# EAGLE design pneumaticsBoard (EAGLE 8.3.2)
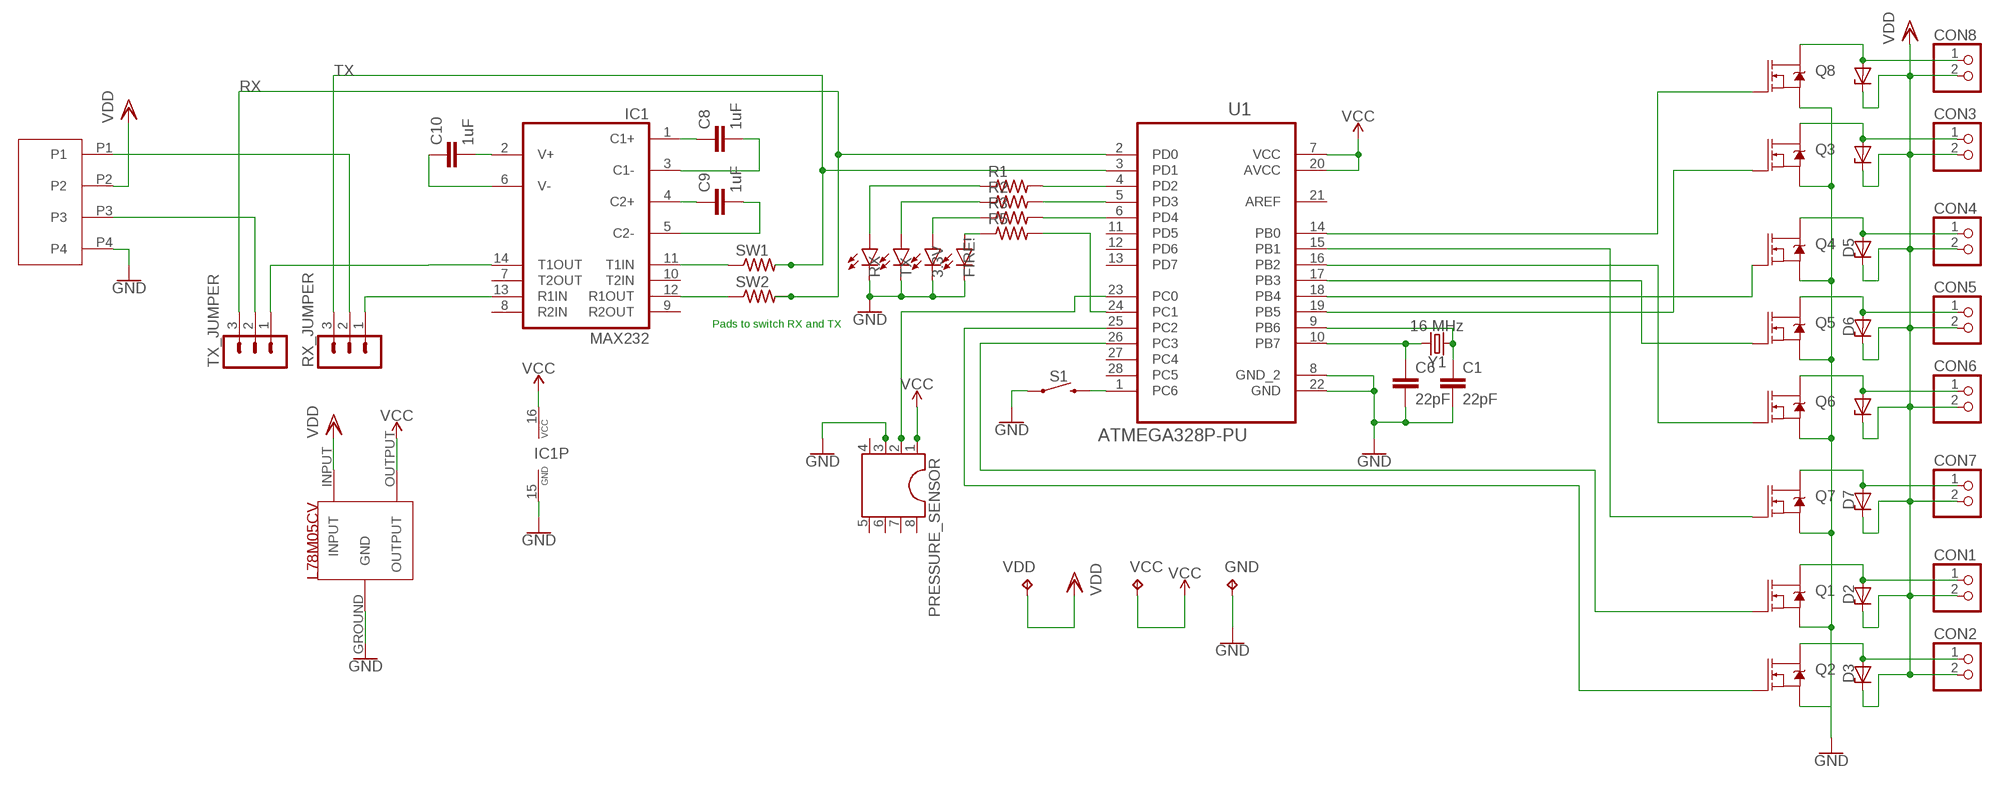
[diagram p0: schematic, sheet 1]

## Parts
3.3V  BLUE  LED-BLUE0603  [LED-0603]
C1  22pF  470PF-0603-50V-5%  [0603]
C6  22pF  470PF-0603-50V-5%  [0603]
C8  1uF  470PF-0603-50V-5%  [0603]
C9  1uF  470PF-0603-50V-5%  [0603]
C10  1uF  470PF-0603-50V-5%  [0603]
CON1  PINHD-1X2  [1X02]
CON2  PINHD-1X2  [1X02]
CON3  PINHD-1X2  [1X02]
CON4  PINHD-1X2  [1X02]
CON5  PINHD-1X2  [1X02]
CON6  PINHD-1X2  [1X02]
CON7  PINHD-1X2  [1X02]
CON8  PINHD-1X2  [1X02]
D1  BZX90  [DO34Z7]
D2  BZX90  [DO34Z7]
D3  BZX90  [DO34Z7]
D4  BZX90  [DO34Z7]
D5  BZX90  [DO34Z7]
D6  BZX90  [DO34Z7]
D7  BZX90  [DO34Z7]
D8  BZX90  [DO34Z7]
FIRE!  BLUE  LED-BLUE0603  [LED-0603]
GND  TPTP11R  [TP11R]
IC1  MAX232  [DIL16]
PRESSURE_SENSOR  DIL8  [DIL08]
Q1  60V/32A/35mΩ  MOSFET-NCH-FQP30N06L  [TO220V]
Q2  60V/32A/35mΩ  MOSFET-NCH-FQP30N06L  [TO220V]
Q3  60V/32A/35mΩ  MOSFET-NCH-FQP30N06L  [TO220V]
Q4  60V/32A/35mΩ  MOSFET-NCH-FQP30N06L  [TO220V]
Q5  60V/32A/35mΩ  MOSFET-NCH-FQP30N06L  [TO220V]
Q6  60V/32A/35mΩ  MOSFET-NCH-FQP30N06L  [TO220V]
Q7  60V/32A/35mΩ  MOSFET-NCH-FQP30N06L  [TO220V]
Q8  60V/32A/35mΩ  MOSFET-NCH-FQP30N06L  [TO220V]
R1  R-US_0204/2V  [0204V]
R2  R-US_0204/2V  [0204V]
R3  R-US_0204/2V  [0204V]
R5  R-US_0204/2V  [0204V]
RX  BLUE  LED-BLUE0603  [LED-0603]
RX_JUMPER  MA03-1  [MA03-1]
S1  MOMENTARY-SWITCH-SPST-PTH-6.0MM  [TACTILE_SWITCH_PTH_6.0MM]
SW1  R-US_0204/2V  [0204V]
SW2  R-US_0204/2V  [0204V]
TX  BLUE  LED-BLUE0603  [LED-0603]
TX_JUMPER  MA03-1  [MA03-1]
U1  ATMEGA328P-PU  [DIP254P762X457-28]
U$1  L78M05CV  [L78M05CV]
U$2  MINI_FIT_JR_4PIN_VERT  [MINI_FIT_JR_4PIN_VERT]
VCC  TPTP11R  [TP11R]
VDD  TPTP11R  [TP11R]
Y1  16 MHz  CRYSTALPTH-HC49UV  [HC49U]

## Nets
CON1_GND: CON1.1 D2.A Q1.2(D)
CON2_GND: CON2.1 D3.A Q2.2(D)
CON3_GND: CON3.1 D4.A Q3.2(D)
CON4_GND: CON4.1 D5.A Q4.2(D)
CON5_GND: CON5.1 D6.A Q5.2(D)
CON6_GND: CON6.1 D8.A Q6.2(D)
CON7_GND: CON7.1 D7.A Q7.2(D)
CON8_GND: CON8.1 D1.A Q8.2(D)
GND: 3.3V.C C1.2 C6.2 FIRE!.C GND.TP IC1.15(GND) PRESSURE_SENSOR.3 Q1.3(S) Q2.3(S) Q3.3(S) Q4.3(S) Q5.3(S) Q6.3(S) Q7.3(S) Q8.3(S) RX.C S1.1 TX.C U1.8(GND_2) U1.22(GND) U$1.GROUND(GND) U$2.P4
N$1: R3.2 U1.6(PD4)
N$2: FIRE!.A R5.1
N$3: IC1.14(T1OUT) TX_JUMPER.1
N$4: R5.2 U1.24(PC1)
N$5: Q4.1(G) U1.18(PB4)
N$7: R1.2 U1.4(PD2)
N$8: R2.2 U1.5(PD3)
N$9: C8.1 IC1.1(C1+)
N$10: C9.1 IC1.4(C2+)
N$11: C8.2 IC1.3(C1-)
N$12: C9.2 IC1.5(C2-)
N$13: C10.2 IC1.2(V+)
N$14: C10.1 IC1.6(V-)
N$16: IC1.13(R1IN) RX_JUMPER.1
N$17: IC1.11(T1IN) SW1.1
N$18: IC1.12(R1OUT) SW2.1
POWER: 3.3V.A R3.1
PRESSURE: PRESSURE_SENSOR.2 U1.23(PC0)
Q1: Q1.1(G) U1.26(PC3)
Q2: Q2.1(G) U1.25(PC2)
Q3: Q3.1(G) U1.19(PB5)
Q5: Q5.1(G) U1.17(PB3)
Q6: Q6.1(G) U1.16(PB2)
Q7: Q7.1(G) U1.15(PB1)
Q8: Q8.1(G) U1.14(PB0)
RESET: S1.3 U1.1(PC6)
RX: SW2.2 TX_JUMPER.3 U1.2(PD0)
RX_ON: R1.1 RX.A
RX_ORIGINAL: RX_JUMPER.2 U$2.P1
TX: RX_JUMPER.3 SW1.2 U1.3(PD1)
TX_ON: R2.1 TX.A
TX_ORIGINAL: TX_JUMPER.2 U$2.P3
VCC: IC1.16(VCC) PRESSURE_SENSOR.1 U1.7(VCC) U1.20(AVCC) U$1.OUTPUT VCC.TP
VDD: CON1.2 CON2.2 CON3.2 CON4.2 CON5.2 CON6.2 CON7.2 CON8.2 D1.C D2.C D3.C D4.C D5.C D6.C D7.C D8.C U$1.INPUT U$2.P2 VDD.TP
XTAL1: C1.1 U1.9(PB6) Y1.1
XTAL2: C6.1 U1.10(PB7) Y1.2
Unconnected: IC1.7(T2OUT) IC1.8(R2IN) IC1.9(R2OUT) IC1.10(T2IN) PRESSURE_SENSOR.4 PRESSURE_SENSOR.5 PRESSURE_SENSOR.6 PRESSURE_SENSOR.7 PRESSURE_SENSOR.8 U1.11(PD5) U1.12(PD6) U1.13(PD7) U1.21(AREF) U1.27(PC4) U1.28(PC5)

## Notes on the sheet
- Pads to switch RX and TX

## Library data of the parts
3.3V FIRE! RX TX = SparkFun-LED:LED-BLUE: Blue SMD LED Used in manufacturing of various products at SparkFun Packages: 0603 - SMD 0603 package [Product Link] <http://www.digikey.com/product-detail/en/SMLE12BC7TT86/511-1589-2-ND/1641808> 1206 - SMD1206 package [Product Link] <http://www.digikey.com/product-detail/en/lite-on-inc/LTST-C150TBKT/160-1643-1-ND/573584> SparkFun Products: ESP8266 Thing-Dev Board <https://www.sparkfun.com/products/13711> RedBoard <https://www.sparkfun.com/products/12757>; PROD_ID: DIO-08575
C1 C6 C8-C10 = SparkFun-Capacitors:470PF: 470pF ceramic capacitors A capacitor is a passive two-terminal electrical component used to store electrical energy temporarily in an electric field.; PROD_ID: CAP-07884; VALUE: 470pF
CON1-CON8 = pinhead:PINHD-1X2: PIN HEADER
D1-D8 = diode:BZX90: Z DIODE
GND VCC VDD = testpad:TP: Test pad
IC1 = maxim:MAX232: RS232 TRANSCEIVER; MF: MAXIM; MPN: MAX232ACPE+; OC_FARNELL: 9723773; OC_NEWARK: 68K4544
PRESSURE_SENSOR = ic-package:DIL8: Dual In Line / Socket
Q1-Q8 = SparkFun-DiscreteSemi:MOSFET-NCH: N-channel MOSFETs Voltage controlled devices that allow control of high current outputs. SparkFun Products: SparkFun OpenScale <https://www.sparkfun.com/products/13261> SparkFun Digital Sandbox <https://www.sparkfun.com/products/12651> SparkFun Monster Moto Shield <https://www.sparkfun.com/products/10182> SparkFun MOSFET Power Controller <https://www.sparkfun.com/products/11214>; PROD_ID: TRANS-10060
R1-R3 R5 SW1 SW2 = resistor:R-US_: RESISTOR, American symbol
RX_JUMPER TX_JUMPER = con-lstb:MA03-1: PIN HEADER; OC_FARNELL: unknown; OC_NEWARK: unknown
S1 = SparkFun-Switches:MOMENTARY-SWITCH-SPST: Momentary Switch (Pushbutton) - SPST Normally-open (NO) SPST momentary switches (buttons, pushbuttons). Variants PTH-12MM - 12mm square, through-hole Momentary Pushbutton Switch - 12mm Square <https://www.sparkfun.com/products/9190> (COM-09190) PTH-6.0MM, PTH-6.0MM-KIT - 6.0mm square, through-hole Mini Pushbutton Switch <https://www.sparkfun.com/products/97> (COM-00097) KIT package intended for soldering kit's - only one side of pads' copper is exposed. PTH-RIGHT-ANGLE-KIT - Right-angle, through-hole Right Angle Tactile Button <https://www.sparkfun.com/products/10791> - Used on SparkFun BigTime Watch Kit <https://www.sparkfun.com/products/11734> SMD-12MM - 12mm square, surface-mount Tactile Button - SMD (12mm) <https://www.sparkfun.com/products/12993> (COM-12993) Used on SparkFun PicoBoard <https://www.sparkfun.com/products/11888> SMD-4.5MM - 4.5mm Square Trackball Switch Used on SparkFun Blackberry Trackballer Breakout <https://www.sparkfun.com/products/13169> SMD-4.6MMX2.8MM - 4.60mm x 2.80mm, surface mount Used on SparkFun SAMD21 Mini Breakout <https://www.sparkfun.com/products/13664> SMD-5.2MM, SMD-5.2-REDUNDANT - 5.2mm square, surface-mount Mini Pushbutton Switch - SMD <https://www.sparkfun.com/products/8720> (COM-08720) Used on Arduino Pro Mini <https://www.sparkfun.com/products/11114> REDUNDANT package connects both switch circuits together SMD-6.0X3.5MM - 6.0 x 3.5mm, surface mount Momentary Reset Switch SMD <https://www.sparkfun.com/products/8229> (COM-08229) SMD-6.2MM-TALL - 6.2mm square, surface mount Tactile Button - SMD (6mm) <https://www.sparkfun.com/products/12992> Used on SparkFun Digital Sandbox <https://www.sparkfun.com/products/12651> SMD-RIGHT-ANGLE - Right-angle, surface mount Used on SparkFun Block for Intel® Edison - Arduino <https://www.sparkfun.com/products/13036>; PROD_ID: SWCH-08441; SF_SKU: COM-00097
U1 = Atmel_By_element14_Batch_1-00:ATMEGA328P-PU: 8-bit Microcontroller with In-System Programmable Flash; MPN: ATMEGA328P-PU; OC_FARNELL: 1715487; OC_NEWARK: 15R0268; PACKAGE: PDIP-28; SUPPLIER: Atmel
U$1 = L78M05CV:L78M05CV
U$2 = 15-24-6041:MINI_FIT_JR_4PIN_VERT
Y1 = SparkFun-Clocks:CRYSTAL: Crystals (Generic) These are passive quartz crystals, which can be used as a clock source for a microcontroller. Crystal's are two-terminal devices. They require external "load" capacitors to generate an oscillating signal.

## Board
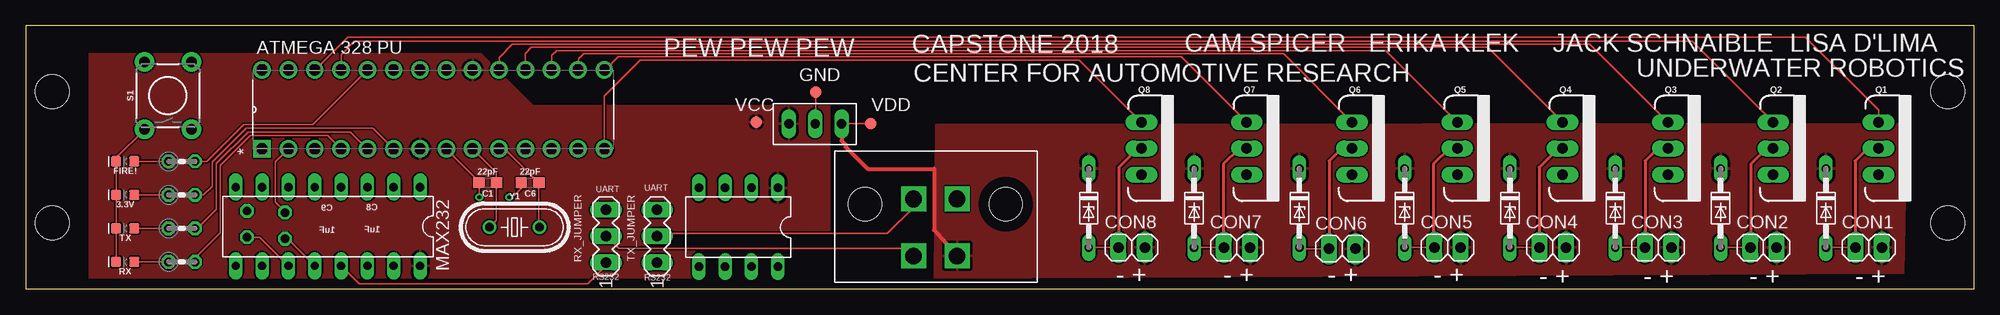
[diagram p1: board, top side]
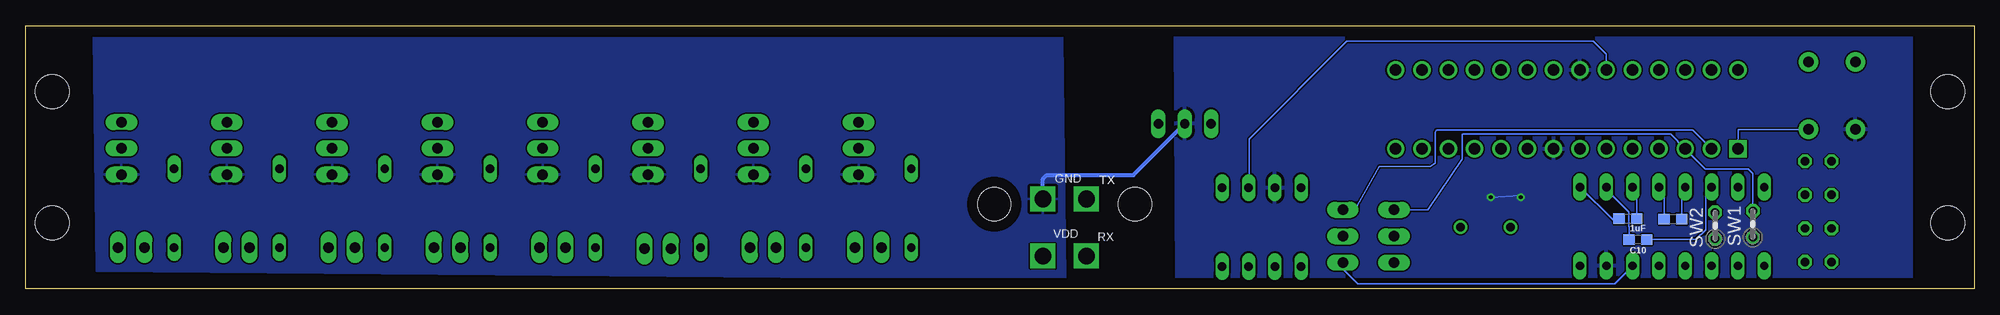
[diagram p2: board, bottom side, seen from below]

Size 187.96 x 25.4 mm. Coordinates in mm from the lower left corner, seen from the top.
Outline: 0,0 187.96,0 187.96,25.4 0,25.4 0,0
Copper layers (1*16): Top 0.035mm / dielectric 1.5mm / Bottom 0.035mm
Design rules "default": minimum track width 6mil, minimum drill 0.35mm, track to track 6mil, track to pad 6mil, pad to pad 6mil, via to via 6mil, smd to smd 6mil, copper to edge 40mil, drill to drill 6mil, minimum pad ring 10mil, minimum via ring 8mil, stop-mask expansion 4mil, vias tented up to drill 0mil, thermal gap 10mil
Holes 3.26 mm at 2.54,6.35 2.54,19.05 185.42,19.05 185.42,6.35

### Footprints (pad centres in the part's own frame; a part is rotated, then mirrored left to right if it is on the bottom)
LED-0603 = smd 1 x 1: A -0.877,0; C 0.877,0
0603 = smd 1.1 x 1: 1 -0.85,0; 2 0.85,0
1X02 = drill 1.016 long: 1 -1.27,0; 2 1.27,0
DO34Z7 = drill 0.813 long: A 3.81,0; C -3.81,0
TP11R = smd 1.1 x 1.1: TP 0,0
DIL16 = drill 0.813 long: 1 -8.89,-3.81; 2 -6.35,-3.81; 3 -3.81,-3.81; 4 -1.27,-3.81; 5 1.27,-3.81; 6 3.81,-3.81; 7 6.35,-3.81; 8 8.89,-3.81; 9 8.89,3.81; 10 6.35,3.81; 11 3.81,3.81; 12 1.27,3.81; 13 -1.27,3.81; 14 -3.81,3.81; 15 -6.35,3.81; 16 -8.89,3.81
DIL08 = drill 0.813 long: 1 -3.81,-3.81; 2 -1.27,-3.81; 3 1.27,-3.81; 4 3.81,-3.81; 5 3.81,3.81; 6 1.27,3.81; 7 -1.27,3.81; 8 -3.81,3.81
TO220V = drill 1.016 long: 1 -2.54,0; 2 0,0; 3 2.54,0
0204V = drill 0.813 octagon: 1 -1.27,0; 2 1.27,0
MA03-1 = drill 1.016 long: 1 -2.54,0; 2 0,0; 3 2.54,0
TACTILE_SWITCH_PTH_6.0MM = drill 1.016 pad 1.88: 1 -3.251,2.261; 2 3.251,2.261; 3 -3.251,-2.261; 4 3.251,-2.261
DIP254P762X457-28 = drill 1.118 square: 1 -7.62,33.02 | drill 1.118: 2 -7.62,30.48; 3 -7.62,27.94; 4 -7.62,25.4; 5 -7.62,22.86; 6 -7.62,20.32; 7 -7.62,17.78; 8 -7.62,15.24; 9 -7.62,12.7; 10 -7.62,10.16; 11 -7.62,7.62; 12 -7.62,5.08; 13 -7.62,2.54; 14 -7.62,0; 15 0,0; 16 0,2.54; 17 0,5.08; 18 0,7.62; 19 0,10.16; 20 0,12.7; 21 0,15.24; 22 0,17.78; 23 0,20.32; 24 0,22.86; 25 0,25.4; 26 0,27.94; 27 0,30.48; 28 0,33.02
L78M05CV = drill 0.9 long: GROUND 2.54,2.54; INPUT 5.08,2.54; OUTPUT 0,2.54
MINI_FIT_JR_4PIN_VERT = drill 1.6 square: P1 0,0; P2 4.191,0; P3 0,5.512; P4 4.191,5.512 | hole 3.2: -4.699,5.004; 8.89,5.004
HC49U = drill 0.813: 1 -2.413,0; 2 2.413,0

### Placement (x,y rotation side)
3.3V  9.58,9.07 180 top
C1  44.55,10.24 180 top
C6  48.64,10.24 180 top
C8  33.4,6.78 0 bottom
C9  29.06,6.73 0 bottom
C10  32.44,4.75 180 bottom
CON1  177.8,3.99 0 top
CON2  167.64,3.99 0 top
CON3  157.48,3.99 0 top
CON4  147.32,3.99 0 top
CON5  137.16,3.99 0 top
CON6  127,3.86 0 top
CON7  116.84,3.99 0 top
CON8  106.68,3.99 0 top
D1  102.54,7.8 270 top
D2  173.66,7.8 270 top
D3  163.5,7.8 270 top
D4  153.34,7.8 270 top
D5  143.18,7.8 270 top
D6  133.02,7.8 270 top
D7  112.7,7.8 270 top
D8  122.86,7.8 270 top
FIRE!  9.58,12.31 180 top
GND  76.2,18.99 0 top
IC1  29.13,6.02 180 top
PRESSURE_SENSOR  68.73,5.94 180 top
Q1  178.74,13.56 270 top
Q2  168.58,13.56 270 top
Q3  158.42,13.56 270 top
Q4  148.26,13.56 270 top
Q5  138.1,13.56 270 top
Q6  127.94,13.56 270 top
Q7  117.78,13.56 270 top
Q8  107.62,13.56 270 top
R1  15.04,2.59 0 top
R2  15.04,5.83 0 top
R3  15.04,9.07 0 top
R5  15.04,12.31 0 top
RX  9.58,2.59 180 top
RX_JUMPER  55.96,5.08 90 top
S1  13.7,18.66 90 top
SW1  21.34,6.25 90 bottom
SW2  24.99,6.1 90 bottom
TX  9.58,5.83 180 top
TX_JUMPER  60.91,5.08 90 top
U1  55.8,21.13 90 top
U$1  73.61,13.41 0 top
U$2  85.65,3.16 0 top
VCC  70.47,16.09 0 top
VDD  81.51,15.94 0 top
Y1  47.14,5.94 0 top

### Tracks (layer width: path | path; a pad name or v marks a point on that pad's centre or on a via)
CON1_GND
  Top 0.152: CON1.1 D2.A
  Top 0.305: Q1.2 177.7,13.56 176.48,12.34 176.48,4.04 CON1.1
CON2_GND
  Top 0.152: CON2.1 166.27,3.99 D3.A
  Top 0.305: Q2.2 167.94,13.56 166.42,12.04 166.42,4.14 166.27,3.99
CON3_GND
  Top 0.152: CON3.1 D4.A
  Top 0.305: Q3.2 157.43,13.56 156.21,12.34 CON3.1
CON4_GND
  Top 0.152: CON4.1 146,3.99 D5.A
  Top 0.305: Q4.2 147.83,13.56 146,11.73 146,3.99
CON5_GND
  Top 0.152: CON5.1 135.64,3.99 D6.A
  Top 0.305: Q5.2 137.31,13.56 135.79,12.04 135.79,4.14 135.64,3.99
CON6_GND
  Top 0.152: CON6.1 125.58,3.86 122.99,3.86 D8.A
  Top 0.305: Q6.2 126.95,13.56 125.73,12.34 125.73,4.01 125.58,3.86
CON7_GND
  Top 0.152: CON7.1 115.37,3.99 D7.A
  Top 0.305: Q7.2 117.04,13.56 115.52,12.04 115.52,4.14 115.37,3.99
CON8_GND
  Top 0.152: CON8.1 105.16,3.99 D1.A
  Top 0.305: Q8.2 107.29,13.56 105.46,11.73 105.46,4.29 105.16,3.99
GND  (via drill 0.35)
  Top 0.152: RX.C TX.C 3.3V.C FIRE!.C 8.7,12.66 S1.1 | C6.2 47.79,9.69 47.09,8.99 v46.63,8.84 | v43.74,8.84 43.74,10.2 C1.2 43.7,10.38 U1.8 | GND.TP 76.2,16 U$1.GROUND
  Bottom 0.152: v46.63,8.84 43.74,8.99 v43.74,8.84
  Bottom 0.406: U$2.P4 89.84,10.59 89.46,10.97 82.13,10.97 82.12,10.99 81.11,10.99 U$1.GROUND
  pour Bottom: 87.95,24.3 87.62,0.88 181.15,1.7 181.48,24.49
  pour Bottom: 6.05,25.02 77.06,25.02 76.91,0.51 6.05,0.51
N$1
  Top 0.152: R3.2 17.12,9.07 17.96,9.91 17.96,12.24 21.23,15.52 33.48,15.52 U1.6
N$2
  Top 0.152: FIRE!.A R5.1
N$3
  Bottom 0.152: TX_JUMPER.1 60.91,1.91 59.49,0.48 34.67,0.48 IC1.14
N$4
  Top 0.152: R5.2 17.44,12.31 21.01,15.88 27.69,15.88 U1.24
N$5
  Top 0.152: U1.18 48.18,22.73 48.77,23.32 141.05,23.32 Q4.1
N$7
  Top 0.152: R1.2 16.31,2.92 18.77,5.38 18.77,11.91 21.67,14.81 29.11,14.81 U1.4
N$8
  Top 0.152: R2.2 16.55,5.83 18.36,7.64 18.36,12.09 21.44,15.16 31.29,15.16 U1.5
N$9
  Bottom 0.152: C8.1 34.82,6.63 IC1.1
N$10
  Bottom 0.152: C9.1 29.91,9.33 IC1.4
N$11
  Bottom 0.152: C8.2 32.55,9.44 IC1.3
N$12
  Bottom 0.152: C9.2 28.21,9.49 IC1.5
N$13
  Bottom 0.152: C10.2 33.29,5.99 33.33,6.04 33.33,7.42 34.9,8.99 34.9,9.25 IC1.2
N$14
  Bottom 0.152: IC1.6 25.91,9.25 25.91,5.68 26.83,4.75 C10.1
N$16
  Top 0.152: RX_JUMPER.1 55.96,2.21 54.2,0.46 32.16,0.46 IC1.13
N$17
  Top 0.152: SW1.1 22.55,4.98 IC1.11
N$18
  Top 0.152: SW2.1 25.25,4.83 IC1.12
POWER
  Top 0.152: 3.3V.A R3.1
PRESSURE
  Bottom 0.152: U1.23 35.48,22.68 36.73,23.93 60.5,23.93 69.95,14.48 69.95,9.8 PRESSURE_SENSOR.2
Q1
  Top 0.152: Q1.1 178.74,17.25 171.68,24.31 31.04,24.31 U1.26
Q2
  Top 0.152: U1.25 30.4,22.63 31.7,23.93 160.76,23.93 Q2.1
Q3
  Top 0.152: U1.19 45.64,22.33 46.94,23.62 150.9,23.62 Q3.1
Q5
  Top 0.152: U1.17 50.72,21.16 50.75,22.55 51.21,23.01 52.58,23.01 131.22,23.01 137.77,16.46 137.77,16.43 Q5.1
Q6
  Top 0.152: U1.16 53.26,21.72 53.34,22.25 53.8,22.71 121.34,22.71 Q6.1
Q7
  Top 0.152: U1.15 55.88,21.13 57.15,22.4 111.48,22.4 Q7.1
Q8
  Top 0.152: U1.14 55.8,18.62 59.28,22.1 101.62,22.1 Q8.1
RESET
  Bottom 0.152: S1.3 22.77,15.4 U1.1
RX
  Top 0.152: SW2.2 24.99,7.47 24.08,8.38 24.08,12.27 U1.2
  Bottom 0.152: TX_JUMPER.3 59.74,7.62 57.38,11.81 52.45,11.81 51.99,12.14 51.99,15.11 51.89,15.34 27.15,15.34 U1.2
RX_ON
  Top 0.152: RX.A R1.1
RX_ORIGINAL
  Top 0.152: RX_JUMPER.2 56.01,5.08 57.2,3.89 84.92,3.89 U$2.P1
TX
  Bottom 0.152: RX_JUMPER.3 52.7,7.62 49.4,12.52 49.4,14.94 29.29,14.94 27.9,13.55 U1.3 25.93,11.58 21.79,11.58 21.34,11.12 SW1.2
TX_ON
  Top 0.152: TX.A R2.1
TX_ORIGINAL
  Top 0.152: U$2.P3 85.65,7.87 83.11,5.33 61.16,5.33 TX_JUMPER.2
VCC
  pour Top: 6.1,0.76 77.57,0.76 77.57,17.68 48.92,17.68 43.89,22.71 6.1,22.71
VDD
  Top 0.152: U$1.INPUT 81.5,15.95 VDD.TP
  Top 0.406: U$1.INPUT 78.69,14.28 79.1,13.87 79.1,13.72 81.23,11.58 87.63,11.58 87.63,5.68 U$2.P2
  pour Top: 87.8,15.89 181.47,15.98 181.15,1.5 87.62,1
XTAL1
  Top 0.152: Y1.1 45.4,6.62 C1.1 45.4,11.21 U1.9
XTAL2
  Top 0.152: Y1.2 49.49,6.01 C6.1 46.21,13.51 U1.10

### Text on the board
tPlace: ATMEGA 328 PU | CAPSTONE 2018 | CAM SPICER | ERIKA KLEK | JACK SCHNAIBLE | LISA D'LIMA | PEW PEW PEW | CENTER FOR AUTOMOTIVE RESEARCH | UNDERWATER ROBOTICS | UART | UART | RS232 | RS232 | - + | - + | - + | - + | - + | - + | - + | - +
bPlace: TX | GND | RX | VDD
Measures: - | - | -